# Altium schematic sheet I2C.SchDoc
size A4; SheetNumber: 13; SheetTotal: 15
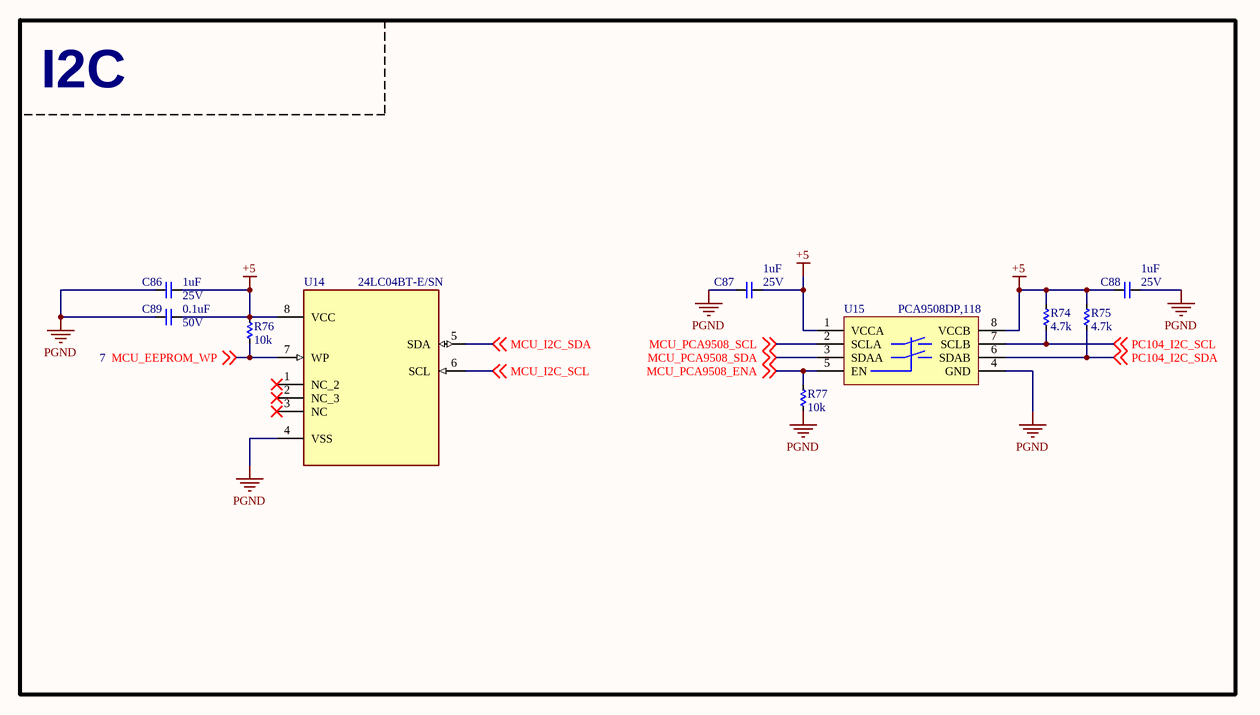
[diagram p0: I2C.SchDoc]

## Parts
C86  1uF  Voltage: 25V  [CAP_C_1608X80]
C87  1uF  Voltage: 25V  [CAP_C_1608X80]
C88  1uF  Voltage: 25V  [CAP_C_1608X80]
C89  0.1uF  Voltage: 50V  [CAP_C_1608X80]
R74  4.7k  [RES_C_1608X60]
R75  4.7k  [RES_C_1608X60]
R76  10k  [RES_C_1608X60]
R77  10k  [RES_C_1608X60]
U14  24LC04BT-E/SN  [SOIC_127]
U15  PCA9508DP,118  [TSOP8]

## Blocks framed on the sheet
I2C: C86-C89 R74-R77 U14 U15

## Nets
+5: C86.1 C87.2 C88.2 C89.1 R74.1 R75.1 R76.1 U14.8(VCC) U15.1(VCCA) U15.8(VCCB)
PGND: C86.2 C87.1 C88.1 C89.2 R77.1 U14.4(VSS) U15.4(GND)
MCU_EEPROM_WP: R76.2 U14.7(WP) ; off-sheet MCU_EEPROM_WP
MCU_I2C_SCL: U14.6(SCL) ; off-sheet MCU_I2C_SCL
MCU_I2C_SDA: U14.5(SDA) ; off-sheet MCU_I2C_SDA
MCU_PCA9508_ENA: R77.2 U15.5(EN) ; off-sheet MCU_PCA9508_ENA
MCU_PCA9508_SCL: U15.2(SCLA) ; off-sheet MCU_PCA9508_SCL
MCU_PCA9508_SDA: U15.3(SDAA) ; off-sheet MCU_PCA9508_SDA
PC104_I2C_SCL: R74.2 U15.7(SCLB) ; off-sheet PC104_I2C_SCL
PC104_I2C_SDA: R75.2 U15.6(SDAB) ; off-sheet PC104_I2C_SDA

Not connected (* = marked no-connect by the designer): U14 1(NC_2)* 2(NC_3)* 3(NC)*

## Library data of the parts
C86-C89 = _CAP_C_2: CAP
R74-R77 = _RES_B_2_2: RES